# Altium schematic sheet GSM.SchDoc
size A4
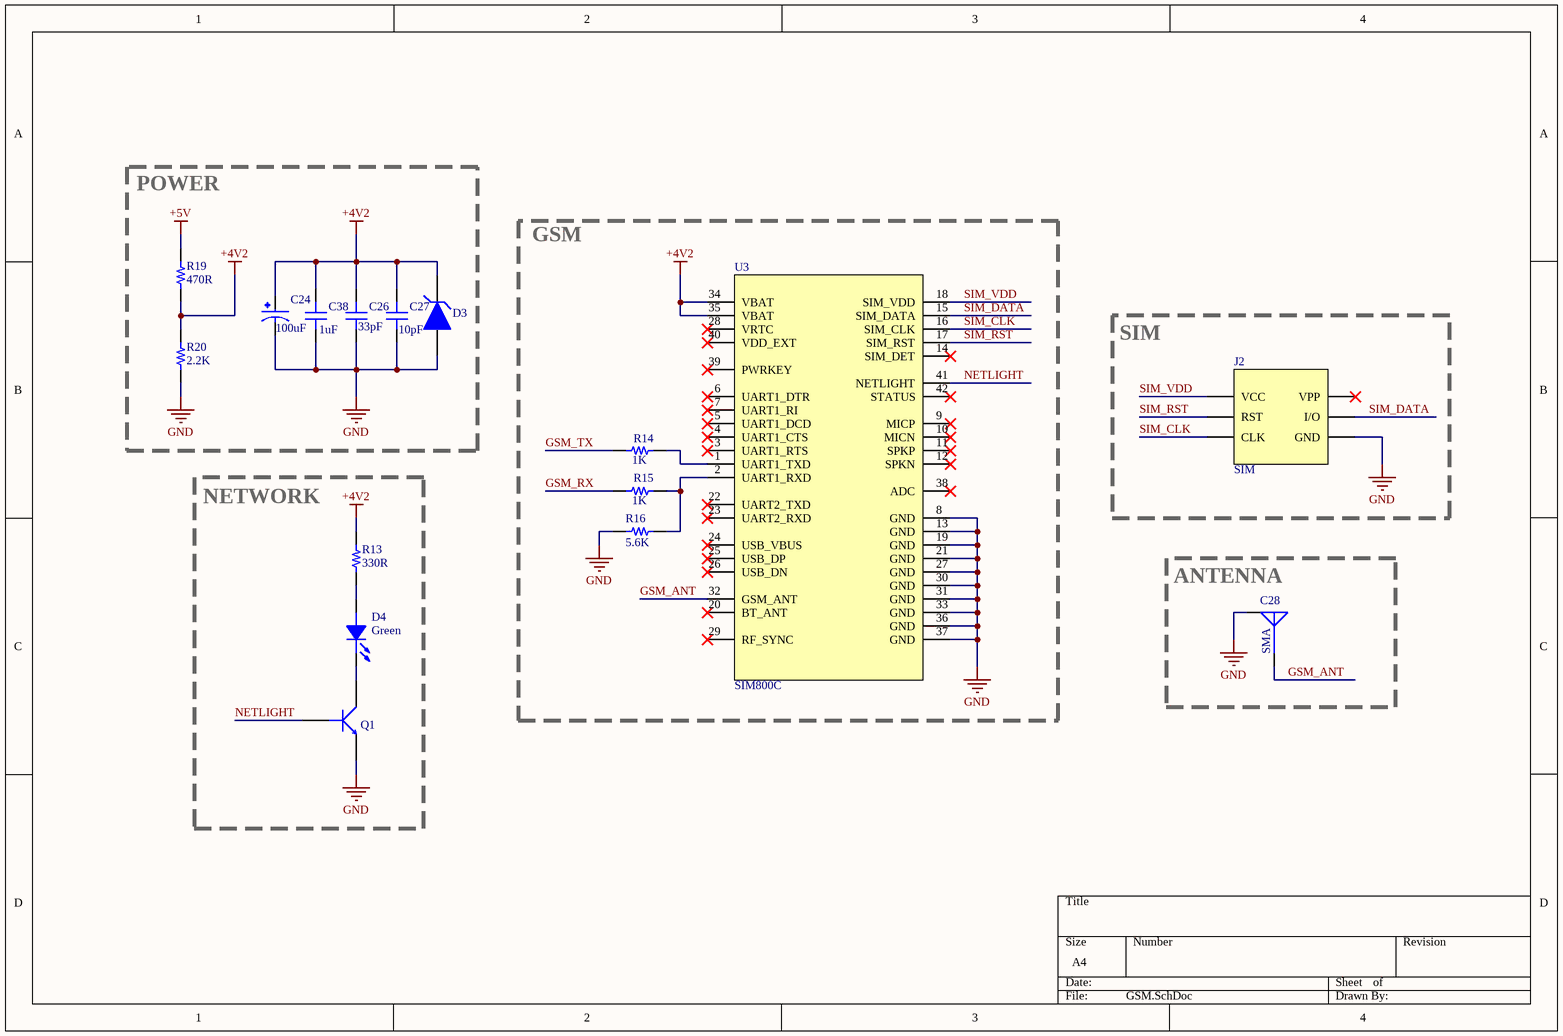
[diagram p0: GSM.SchDoc]

## Parts
C24  100uF  [TANTAL B-CASE]
C26  33pF  [CAP 0603_1608]
C27  10pF  [CAP 0603_1608]
C28  SMA  [132134-11 SMA ANTEN]
C38  1uF  [CAP 0603_1608]
D3  ZENER DIODE  [SOD123]  (value not drawn)
D4  value Green  [0805 Green LED]  (hidden comment: 0805 Green LED)
J2  SIM  [GCT_SIM7100-6-1-15-00-A_REVC]
Q1  MMBT3904-7-F  [SOT-23F]  (value not drawn)
R13  330R  [RES 0603_1608]
R14  1K  [RES 0603_1608]
R15  1K  [RES 0603_1608]
R16  5.6K  [RES 0603_1608]
R19  470R  [RES 0603_1608]
R20  2.2K  [RES 0603_1608]
U3  SIM800C  [LCC110P1570X1760X250-42N]

## Blocks framed on the sheet
POWER: C24 C26 C27 C38 D3 R19 R20
GSM: R14-R16 U3
SIM: J2
NETWORK: D4 Q1 R13
ANTENNA: C28

## Nets
+4V2: C24.+ C26.2 C27.2 C38.2 D3.C R13.2 R19.1 R20.2 U3.34(VBAT) U3.35(VBAT)
+5V: R19.2
GND: C24.- C26.1 C27.1 C28.G C38.1 D3.A J2.C5(GND) Q1.2(E) R16.1 R20.1 U3.8(GND) U3.13(GND) U3.19(GND) U3.21(GND) U3.27(GND) U3.30(GND) U3.31(GND) U3.33(GND) U3.36(GND) U3.37(GND)
GSM_ANT: C28.S U3.32(GSM_ANT)
GSM_RX: R15.1
GSM_TX: R14.1
NETLIGHT: Q1.1(B) U3.41(NETLIGHT)
SIM_CLK: J2.C3(CLK) U3.16(SIM_CLK)
SIM_DATA: J2.C7(I/O) U3.15(SIM_DATA)
SIM_RST: J2.C2(RST) U3.17(SIM_RST)
SIM_VDD: J2.C1(VCC) U3.18(SIM_VDD)
NetD4_1: D4.1(ANODE) R13.1
NetD4_2: D4.2(CATHODE) Q1.3(C)
NetR14_2: R14.2 U3.1(UART1_TXD)
NetR15_2: R15.2 R16.2 U3.2(UART1_RXD)

Not connected (* = marked no-connect by the designer): J2 C6(VPP)*; U3 3(UART1_RTS)* 4(UART1_CTS)* 5(UART1_DCD)* 6(UART1_DTR)* 7(UART1_RI)* 9(MICP)* 10(MICN)* 11(SPKP)* 12(SPKN)* 14(SIM_DET)* 20(BT_ANT)* 22(UART2_TXD)* 23(UART2_RXD)* 24(USB_VBUS)* 25(USB_DP)* 26(USB_DN)* 28(VRTC)* 29(RF_SYNC)* 38(ADC)* 39(PWRKEY)* 40(VDD_EXT)* 42(STATUS)*

## Library data of the parts
C24 = 100uF: TANTAL
C26 = 33pF: CERAMİC 1206 SMD
C27 = 10pF: CERAMİC 1206 SMD
C28 = Anten SMA  2: SMA Anten Connector; ComponentLink1Description: Özdisan; ComponentLink1URL: https://www.ozdisan.com/konnektor-ve-baglanti-elemanlari/koaksiyel-konnektorler/sma-konnektorler/CONSMA002-G
C38 = 1uF: CERAMİC 1206 SMD
D3 = ZENER DIODE: SOD123; Manufacturer: ON Semiconductor; Manufacturer Part Number: 1SMB5919BT3G; Material: Plastic; Max Power Dissipation: 3W; Tolerance: 5%; Max Reverse Leakage Current: 5uA; Impedance: 2R; Zener Voltage: 5.6V; Element Configuration: Single; Forward Voltage: 1.5V; Power Dissipation: 550mW; Zener Current: 267mA; Test Current: 66.9mA; Breakdown Voltage: 5.88V; ESD Protection: Yes; Supplier 1: Digi-Key; RoHS: Yes; Category: Zener Diodes; Pricing 1: 1=0,45000, 10=0,31900, 100=0,16110, 500=0,14274, 1000=0,11109 (USD); Case/Package: SMB; Number of Pins: 2; Contact Plating: Tin,Matte; Min Operating Temperature: -65°C; Max Operating Temperature: 150°C; Package Quantity: 1; Packaging: Tape and Reel; Voltage Tolerance: 5%; Voltage Rating (DC): 5.6V; Power Rating: 3W; Length: 4.32mm; Width: 3.56mm; Height: 2.13mm; Radiation Hardening: No; Lead Free: Lead Free; Halogen Free: Halogen Free; REACH SVHC: No SVHC; ComponentLink2URL: https://datasheet.ciiva.com/1182/1smb5913bt3-d-1182657.pdf?src-supplier=Element14; ComponentLink2Description: https://datasheet.ciiva.com/1182/1smb5913bt3-d-1182657.pdf?src-supplier=Element14; ComponentLink3URL: https://datasheet.ciiva.com/1182/1smb5913bt3-d-1182658.pdf?src-supplier=Element14; ComponentLink3Description: https://datasheet.ciiva.com/1182/1smb5913bt3-d-1182658.pdf?src-supplier=Element14; ComponentLink4URL: https://datasheet.ciiva.com/895/1smb5913bt3-d-895203.pdf?src-supplier=Digi-Key; ComponentLink4Description: https://datasheet.ciiva.com/895/1smb5913bt3-d-895203.pdf?src-supplier=Digi-Key; ComponentLink5URL: https://datasheet.ciiva.com/895/1smb5913bt3-d-895204.pdf?src-supplier=Digi-Key; ComponentLink5Description: https://datasheet.ciiva.com/895/1smb5913bt3-d-895204.pdf?src-supplier=Digi-Key; ComponentLink6URL: https://datasheet.ciiva.com/895/1smb5913bt3-d-895205.pdf?src-supplier=Digi-Key; ComponentLink6Description: https://datasheet.ciiva.com/895/1smb5913bt3-d-895205.pdf?src-supplier=Digi-Key; ComponentLink7URL: https://datasheet.ciiva.com/15198/getdatasheetpartid-311040-15198695.pdf?src-supplier=Verical; ComponentLink7Description: https://datasheet.ciiva.com/15198/getdatasheetpartid-311040-15198695.pdf?src-supplier=Verical; ComponentLink8URL: https://datasheet.ciiva.com/16311/1smb5913bt3-d-16311847.pdf?src-supplier=Future+Electronics; ComponentLink8Description: https://datasheet.ciiva.com/16311/1smb5913bt3-d-16311847.pdf?src-supplier=Future+Electronics; ComponentLink9URL: https://datasheet.ciiva.com/16472/1smb5913bt3-d-16472779.pdf?src-supplier=Avnet+Asia; ComponentLink9Description: https://datasheet.ciiva.com/16472/1smb5913bt3-d-16472779.pdf?src-supplier=Avnet+Asia; Max Reverse Current: 5uA; Supplier Part Number 1: 1SMB5919BT3GOSCT-ND
D4 = 0805 Green LED: Manufacturer: AVAGO Technologies; Manufacturer Code: HSMG-C170; Current: 20mA; Voltage: 2.2V; Farnell Code: 5790852; Unit Price: 0,134 €
J2 = SIM7100-6-1-15-00-A: Memory Card Connectors Micro SIM Card Connector - Push-Push Type, 6 Pin, SMT, 1.50mm Profile; MF: Global Connector Technology; Package: None; Availability: Unavailable; SnapEDA_Link: https://www.snapeda.com/parts/SIM7100-6-1-15-00-A/Global%20Connector%20Technology/view-part/449163/?ref=snap; MP: SIM7100-6-1-15-00-A; Price: None; Value: *; ComponentLink1Description: Özdisan; ComponentLink1URL: https://ozdisan.com/konnektor-ve-baglanti-elemanlari/hafiza-konnektorleri/pc-kart-soketleri/L-KLS1-SIM-064-62P-H1
Q1 = MMBT3904-7-F: Transistor General Purpose BJT NPN 40 Volt 0.2A Automotive 3-Pin SOT-23; Manufacturer: Diodes Zetex; Designed by: BERK; Max Power Dissipation: 300mW; Collector Emitter Voltage (VCEO): 40V; Max Collector Current: 200mA; Collector Base Voltage (VCBO): 60V; Frequency: 300MHz; hFE Min: 100; Number of Elements: 1; Emitter Base Voltage (VEBO): 6V; Collector Emitter Saturation Voltage: 300mV; Power Dissipation: 350mW; Element Configuration: Single; Supplier 1: Digi-Key; Manufacturer Part Number: MMBT3904-7-F; RoHS: Yes; Category: BJTs; Stock 1: 2393281; Pricing 1: 1=0,12000, 10=0,08600, 25=0,08280, 100=0,04660, 500=0,03664, 1000=0,02544 (USD); Mount: Surface Mount; Case/Package: SOT-23; Number of Pins: 3; Weight: 0.000282oz; Contact Plating: Tin,Matte; Min Operating Temperature: -55°C; Max Operating Temperature: 150°C; Polarity: NPN; Packaging: Tape and Reel; Package Quantity: 3000; Transition Frequency: 300MHz; Collector Emitter Breakdown Voltage: 40V; Max Breakdown Voltage: 40V; Continuous Collector Current: 200mA; Max Frequency: 300MHz; Gain Bandwidth Product: 300MHz; Series: -; Collector-emitter Voltage-Max: 300mV; Voltage Rating (DC): 40V; Length: 3.05mm; Width: 1.4mm; Height: 1mm; Radiation Hardening: No; REACH SVHC: No SVHC; Lead Free: Lead Free; RoHS Compliant: Yes; ComponentLink1URL: https://datasheet.ciiva.com/11201/ds30036-11201778.pdf?src-supplier=Avnet; ComponentLink1Description: https://datasheet.ciiva.com/11201/ds30036-11201778.pdf?src-supplier=Avnet; ComponentLink2URL: https://datasheet.ciiva.com/15138/getdatasheetpartid-53265-15138780.pdf?src-supplier=Verical; ComponentLink2Description: https://datasheet.ciiva.com/15138/getdatasheetpartid-53265-15138780.pdf?src-supplier=Verical; ComponentLink3URL: https://datasheet.ciiva.com/6361/ds30036-6361254.pdf?src-supplier=Digi-Key; ComponentLink3Description: https://datasheet.ciiva.com/6361/ds30036-6361254.pdf?src-supplier=Digi-Key; ComponentLink4URL: https://datasheet.ciiva.com/22711/1915516-22711750.pdf?src-supplier=Element14; ComponentLink4Description: https://datasheet.ciiva.com/22711/1915516-22711750.pdf?src-supplier=Element14; ComponentLink5URL: https://datasheet.ciiva.com/11198/ds30036-11198999.pdf?src-supplier=Avnet; ComponentLink5Description: https://datasheet.ciiva.com/11198/ds30036-11198999.pdf?src-supplier=Avnet; ComponentLink6URL: https://datasheet.ciiva.com/6361/ds30036-6361256.pdf?src-supplier=Digi-Key; ComponentLink6Description: https://datasheet.ciiva.com/6361/ds30036-6361256.pdf?src-supplier=Digi-Key; Supplier Part Number 1: MMBT3904-FDIDKR-ND
R13 = 330R: SMT RES 1206
R14 R15 = 1K: SMT RES 1206
R16 = 5.6K: SMT RES 1206
R19 = 470R: SMT RES 1206
R20 = 2.2K: SMT RES 1206
U3 = SIM800C: GSM/Bluetooth; Value: *; Price: None; Package: None; MP: SIM800C; ComponentLink1Description: Robolink; ComponentLink1URL: https://www.robolinkmarket.com/sim800c-gsm-gprs-modulu